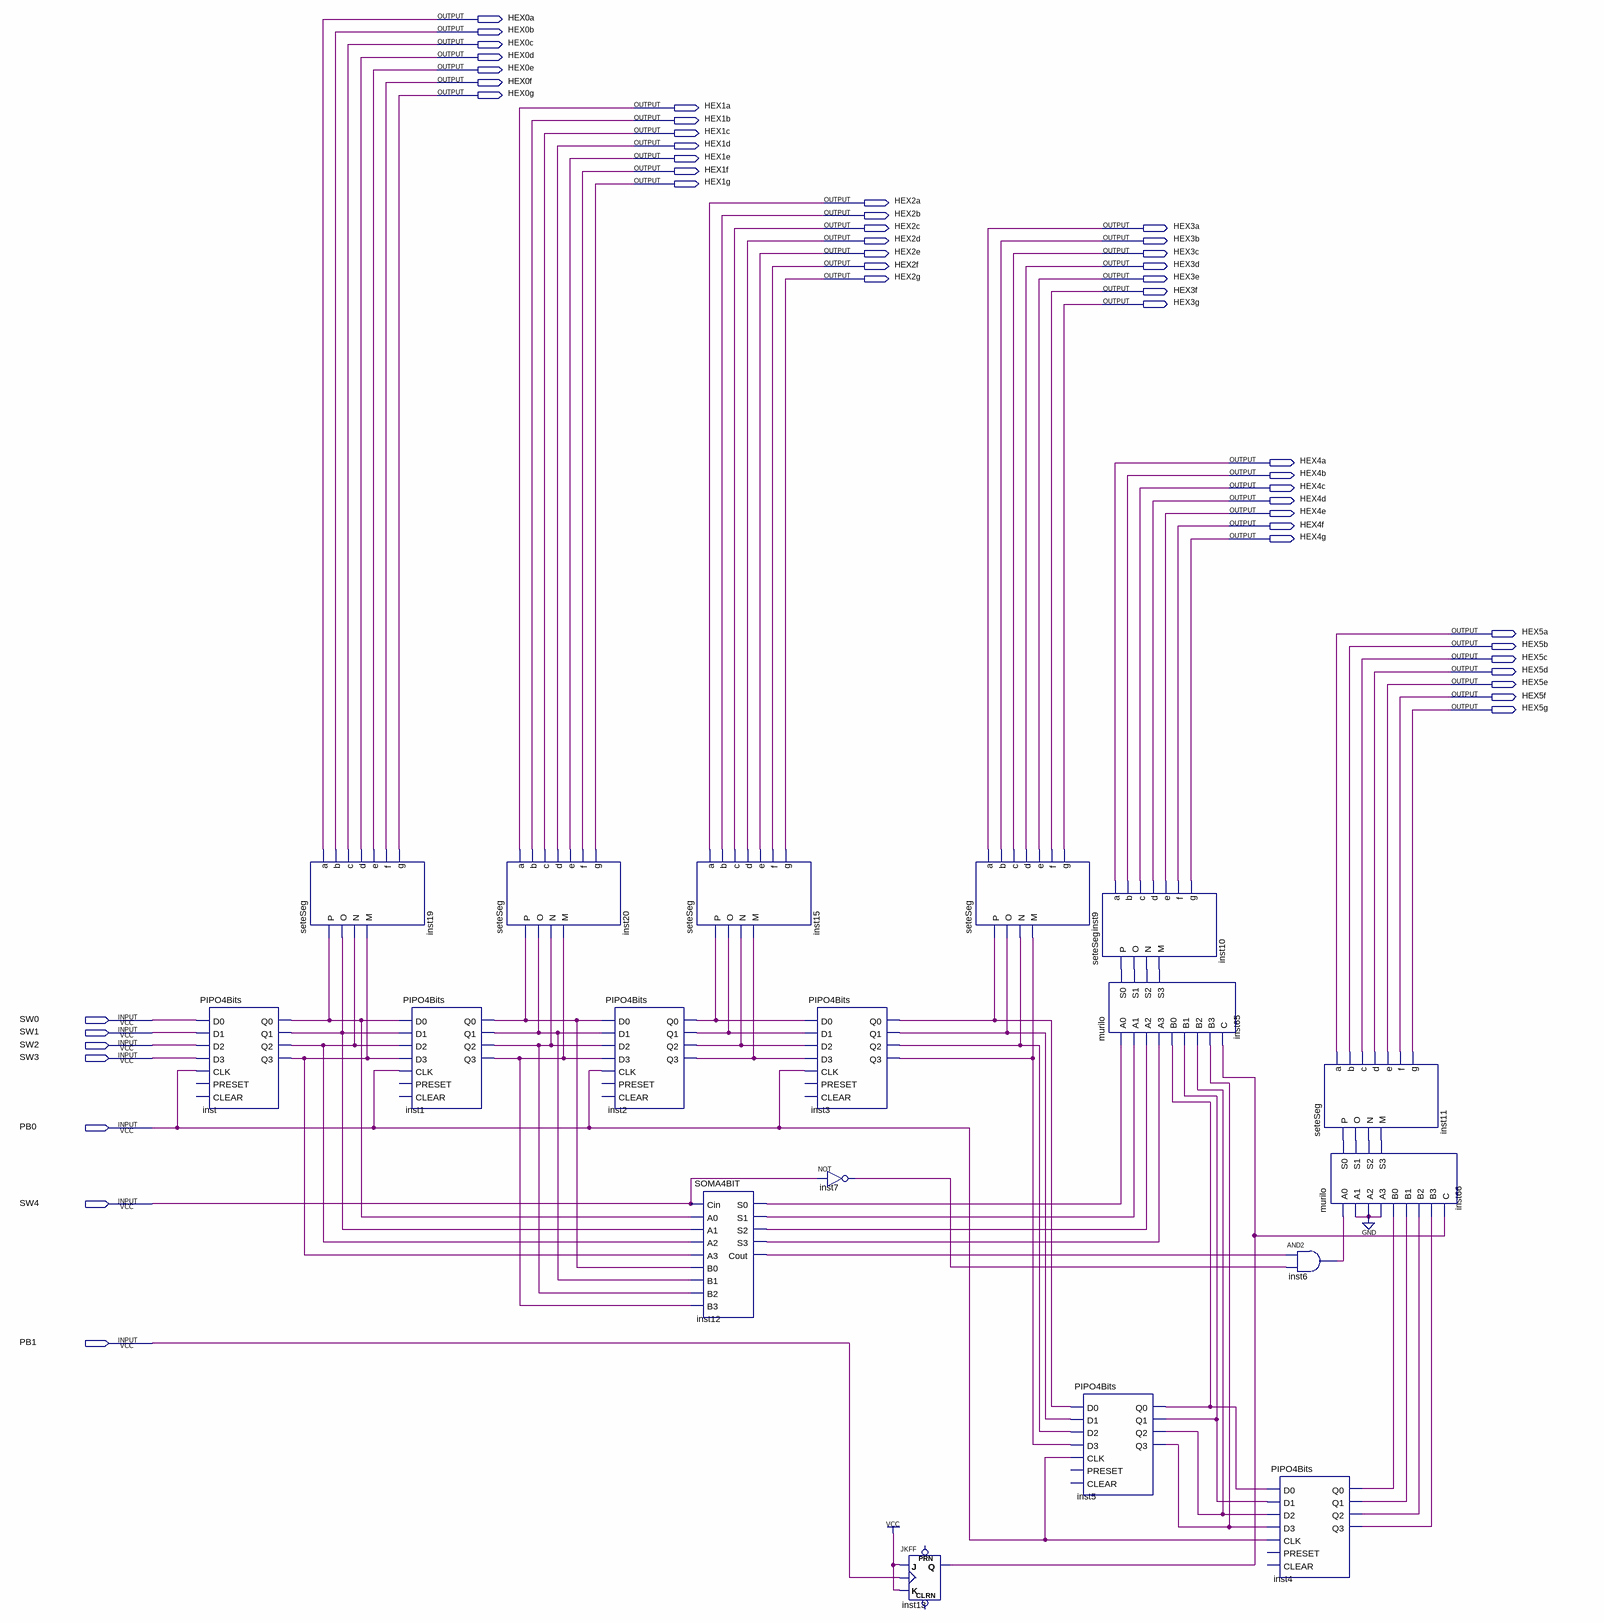
[diagram p0: schematic sheet]
// Quartus schematic lab2_2.bdf as structural Verilog: 18 symbols, 49 pins
module lab2_2 (
  input  SW0,
  input  SW1,
  input  SW2,
  input  SW3,
  input  PB0,
  input  SW4,
  input  PB1,
  output HEX0a,
  output HEX0b,
  output HEX0c,
  output HEX0d,
  output HEX0e,
  output HEX0f,
  output HEX0g,
  output HEX1a,
  output HEX1b,
  output HEX1c,
  output HEX1d,
  output HEX1e,
  output HEX1f,
  output HEX1g,
  output HEX2a,
  output HEX2b,
  output HEX2c,
  output HEX3a,
  output HEX2d,
  output HEX3b,
  output HEX2e,
  output HEX3c,
  output HEX2f,
  output HEX3d,
  output HEX2g,
  output HEX3e,
  output HEX3f,
  output HEX3g,
  output HEX4a,
  output HEX4b,
  output HEX4c,
  output HEX4d,
  output HEX4e,
  output HEX4f,
  output HEX4g,
  output HEX5a,
  output HEX5b,
  output HEX5c,
  output HEX5d,
  output HEX5e,
  output HEX5f,
  output HEX5g
);

  wire inst1_q0, inst1_q1, inst1_q2, inst1_q3, inst2_q0, inst2_q1, inst2_q2, inst2_q3, inst3_q0, inst3_q1,
       inst3_q2, inst3_q3, inst4_q0, inst4_q1, inst4_q2, inst4_q3, inst5_q0, inst5_q1, inst5_q2, inst5_q3,
       inst6_out, inst7_out, inst12_cout, inst12_s0, inst12_s1, inst12_s2, inst12_s3, inst13_q, inst65_s0,
       inst65_s1, inst65_s2, inst65_s3, inst66_s0, inst66_s1, inst66_s2, inst66_s3, inst_q0, inst_q1,
       inst_q2, inst_q3;

  PIPO4Bits inst (
    .D0(SW0), .D1(SW1), .D2(SW2), .D3(SW3), .CLK(PB0), .Q0(inst_q0), .Q1(inst_q1), .Q2(inst_q2), .Q3(inst_q3));  // open: PRESET, CLEAR
  seteSeg inst19 (
    .M(inst_q3), .N(inst_q2), .O(inst_q1), .P(inst_q0), .a(HEX0a), .b(HEX0b), .c(HEX0c), .d(HEX0d),
    .e(HEX0e), .f(HEX0f), .g(HEX0g));
  PIPO4Bits inst1 (
    .D0(inst_q0), .D1(inst_q1), .D2(inst_q2), .D3(inst_q3), .CLK(PB0), .Q0(inst1_q0), .Q1(inst1_q1),
    .Q2(inst1_q2), .Q3(inst1_q3));  // open: PRESET, CLEAR
  seteSeg inst20 (
    .M(inst1_q3), .N(inst1_q2), .O(inst1_q1), .P(inst1_q0), .a(HEX1a), .b(HEX1b), .c(HEX1c), .d(HEX1d),
    .e(HEX1e), .f(HEX1f), .g(HEX1g));
  PIPO4Bits inst2 (
    .D0(inst1_q0), .D1(inst1_q1), .D2(inst1_q2), .D3(inst1_q3), .CLK(PB0), .Q0(inst2_q0), .Q1(inst2_q1),
    .Q2(inst2_q2), .Q3(inst2_q3));  // open: PRESET, CLEAR
  seteSeg inst15 (
    .M(inst2_q3), .N(inst2_q2), .O(inst2_q1), .P(inst2_q0), .a(HEX2a), .b(HEX2b), .c(HEX2c), .d(HEX2d),
    .e(HEX2e), .f(HEX2f), .g(HEX2g));
  SOMA4BIT inst12 (
    .Cin(SW4), .A0(inst_q0), .A1(inst_q1), .A2(inst_q2), .A3(inst_q3), .B0(inst1_q0), .B1(inst1_q1),
    .B2(inst1_q2), .B3(inst1_q3), .S0(inst12_s0), .S1(inst12_s1), .S2(inst12_s2), .S3(inst12_s3),
    .Cout(inst12_cout));
  PIPO4Bits inst3 (
    .D0(inst2_q0), .D1(inst2_q1), .D2(inst2_q2), .D3(inst2_q3), .CLK(PB0), .Q0(inst3_q0), .Q1(inst3_q1),
    .Q2(inst3_q2), .Q3(inst3_q3));  // open: PRESET, CLEAR
  not inst7 (inst7_out, SW4);
  JKFF inst13 (.K(1'b1), .J(1'b1), .CLK(PB1), .Q(inst13_q));  // open: PRN, CLRN
  seteSeg inst9 (
    .M(inst3_q3), .N(inst3_q2), .O(inst3_q1), .P(inst3_q0), .a(HEX3a), .b(HEX3b), .c(HEX3c), .d(HEX3d),
    .e(HEX3e), .f(HEX3f), .g(HEX3g));
  seteSeg inst10 (
    .M(inst65_s3), .N(inst65_s2), .O(inst65_s1), .P(inst65_s0), .a(HEX4a), .b(HEX4b), .c(HEX4c), .d(HEX4d),
    .e(HEX4e), .f(HEX4f), .g(HEX4g));
  murilo inst65 (
    .A0(inst12_s0), .A1(inst12_s1), .A2(inst12_s2), .A3(inst12_s3), .B0(inst5_q0), .B1(inst5_q1),
    .B2(inst5_q2), .B3(inst5_q3), .C(inst13_q), .S0(inst65_s0), .S1(inst65_s1), .S2(inst65_s2), .S3(inst65_s3));
  PIPO4Bits inst5 (
    .D0(inst3_q0), .D1(inst3_q1), .D2(inst3_q2), .D3(inst3_q3), .CLK(PB0), .Q0(inst5_q0), .Q1(inst5_q1),
    .Q2(inst5_q2), .Q3(inst5_q3));  // open: PRESET, CLEAR
  and inst6 (inst6_out, inst12_cout, inst7_out);
  PIPO4Bits inst4 (
    .D0(inst5_q0), .D1(inst5_q1), .D2(inst5_q2), .D3(inst5_q3), .CLK(PB0), .Q0(inst4_q0), .Q1(inst4_q1),
    .Q2(inst4_q2), .Q3(inst4_q3));  // open: PRESET, CLEAR
  seteSeg inst11 (
    .M(inst66_s3), .N(inst66_s2), .O(inst66_s1), .P(inst66_s0), .a(HEX5a), .b(HEX5b), .c(HEX5c), .d(HEX5d),
    .e(HEX5e), .f(HEX5f), .g(HEX5g));
  murilo inst66 (
    .A0(inst6_out), .A1(1'b0), .A2(1'b0), .A3(1'b0), .B0(inst4_q0), .B1(inst4_q1), .B2(inst4_q2),
    .B3(inst4_q3), .C(inst13_q), .S0(inst66_s0), .S1(inst66_s1), .S2(inst66_s2), .S3(inst66_s3));
endmodule
